# EAGLE schematic 8085_V1 (EAGLE 7.6.0)
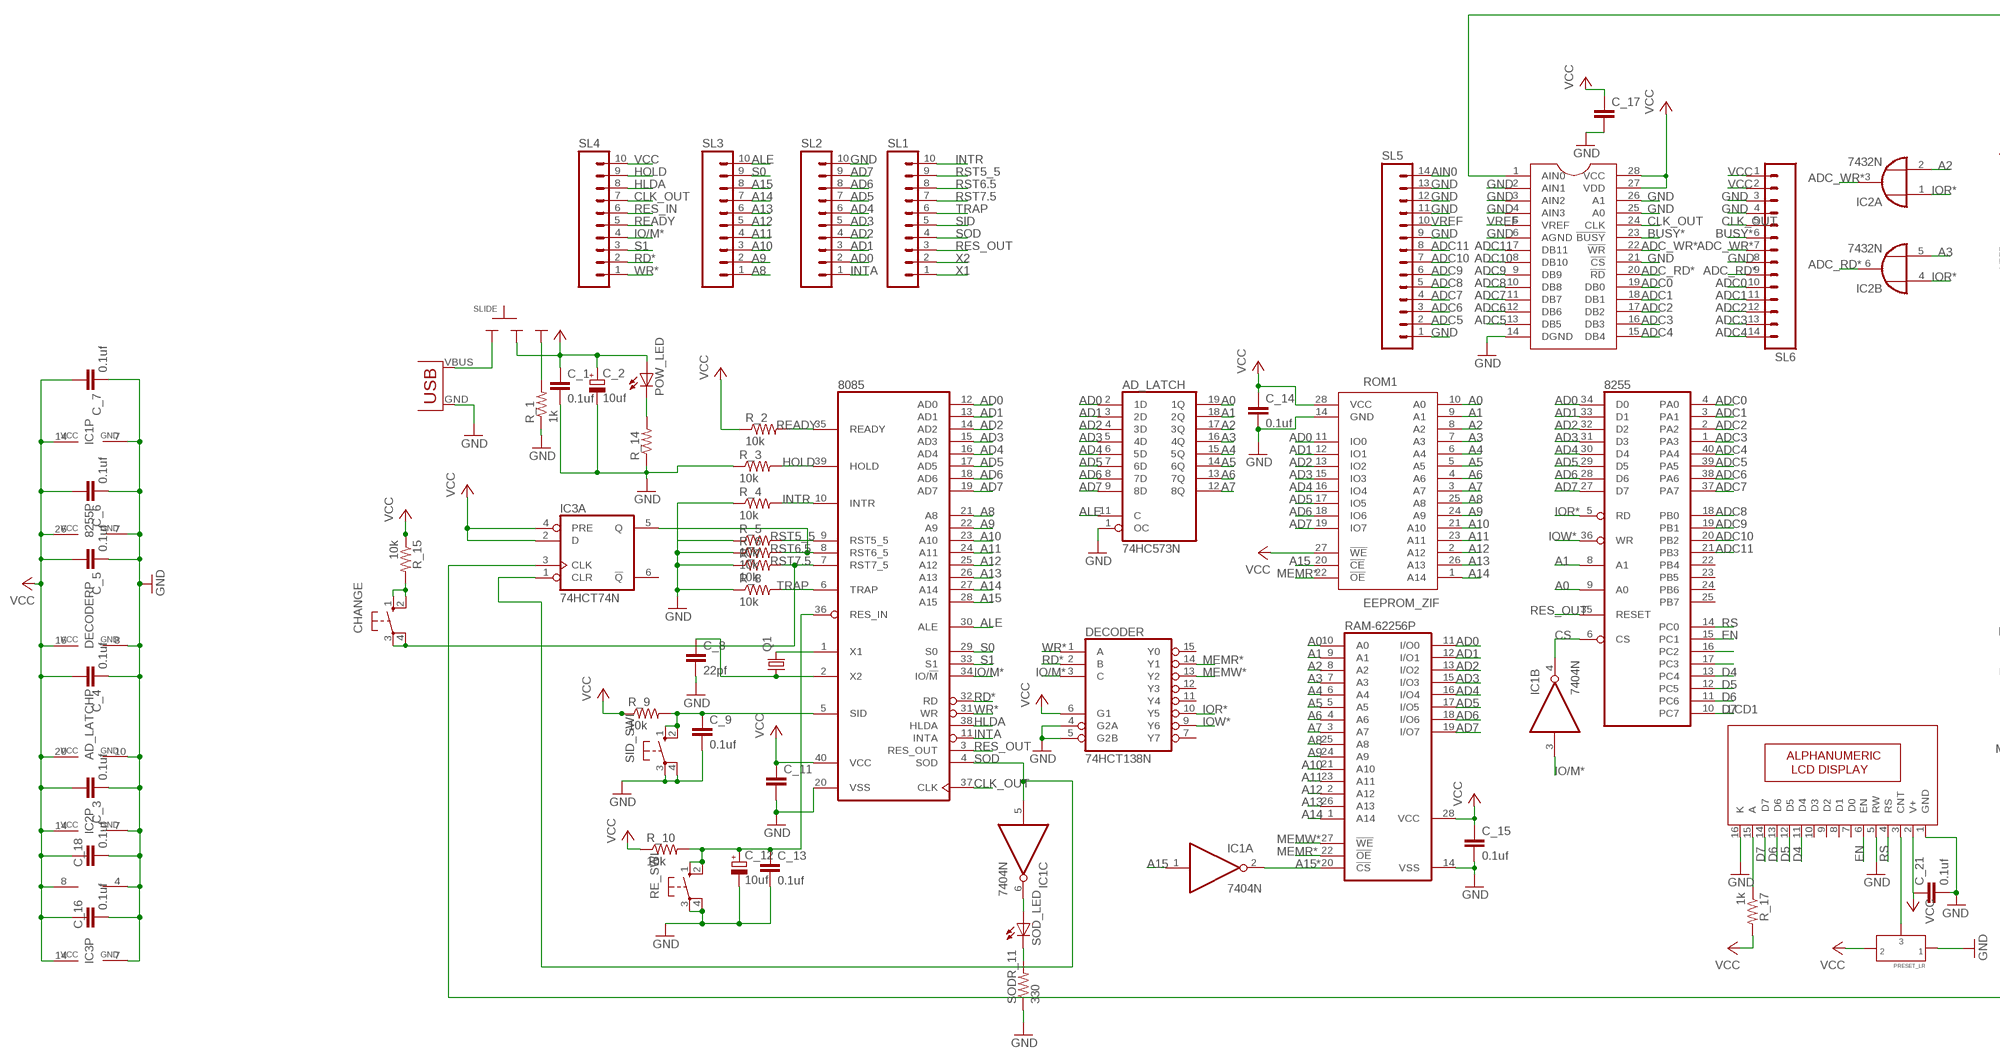
[diagram p0: schematic, sheet 1, part 1 of 2]
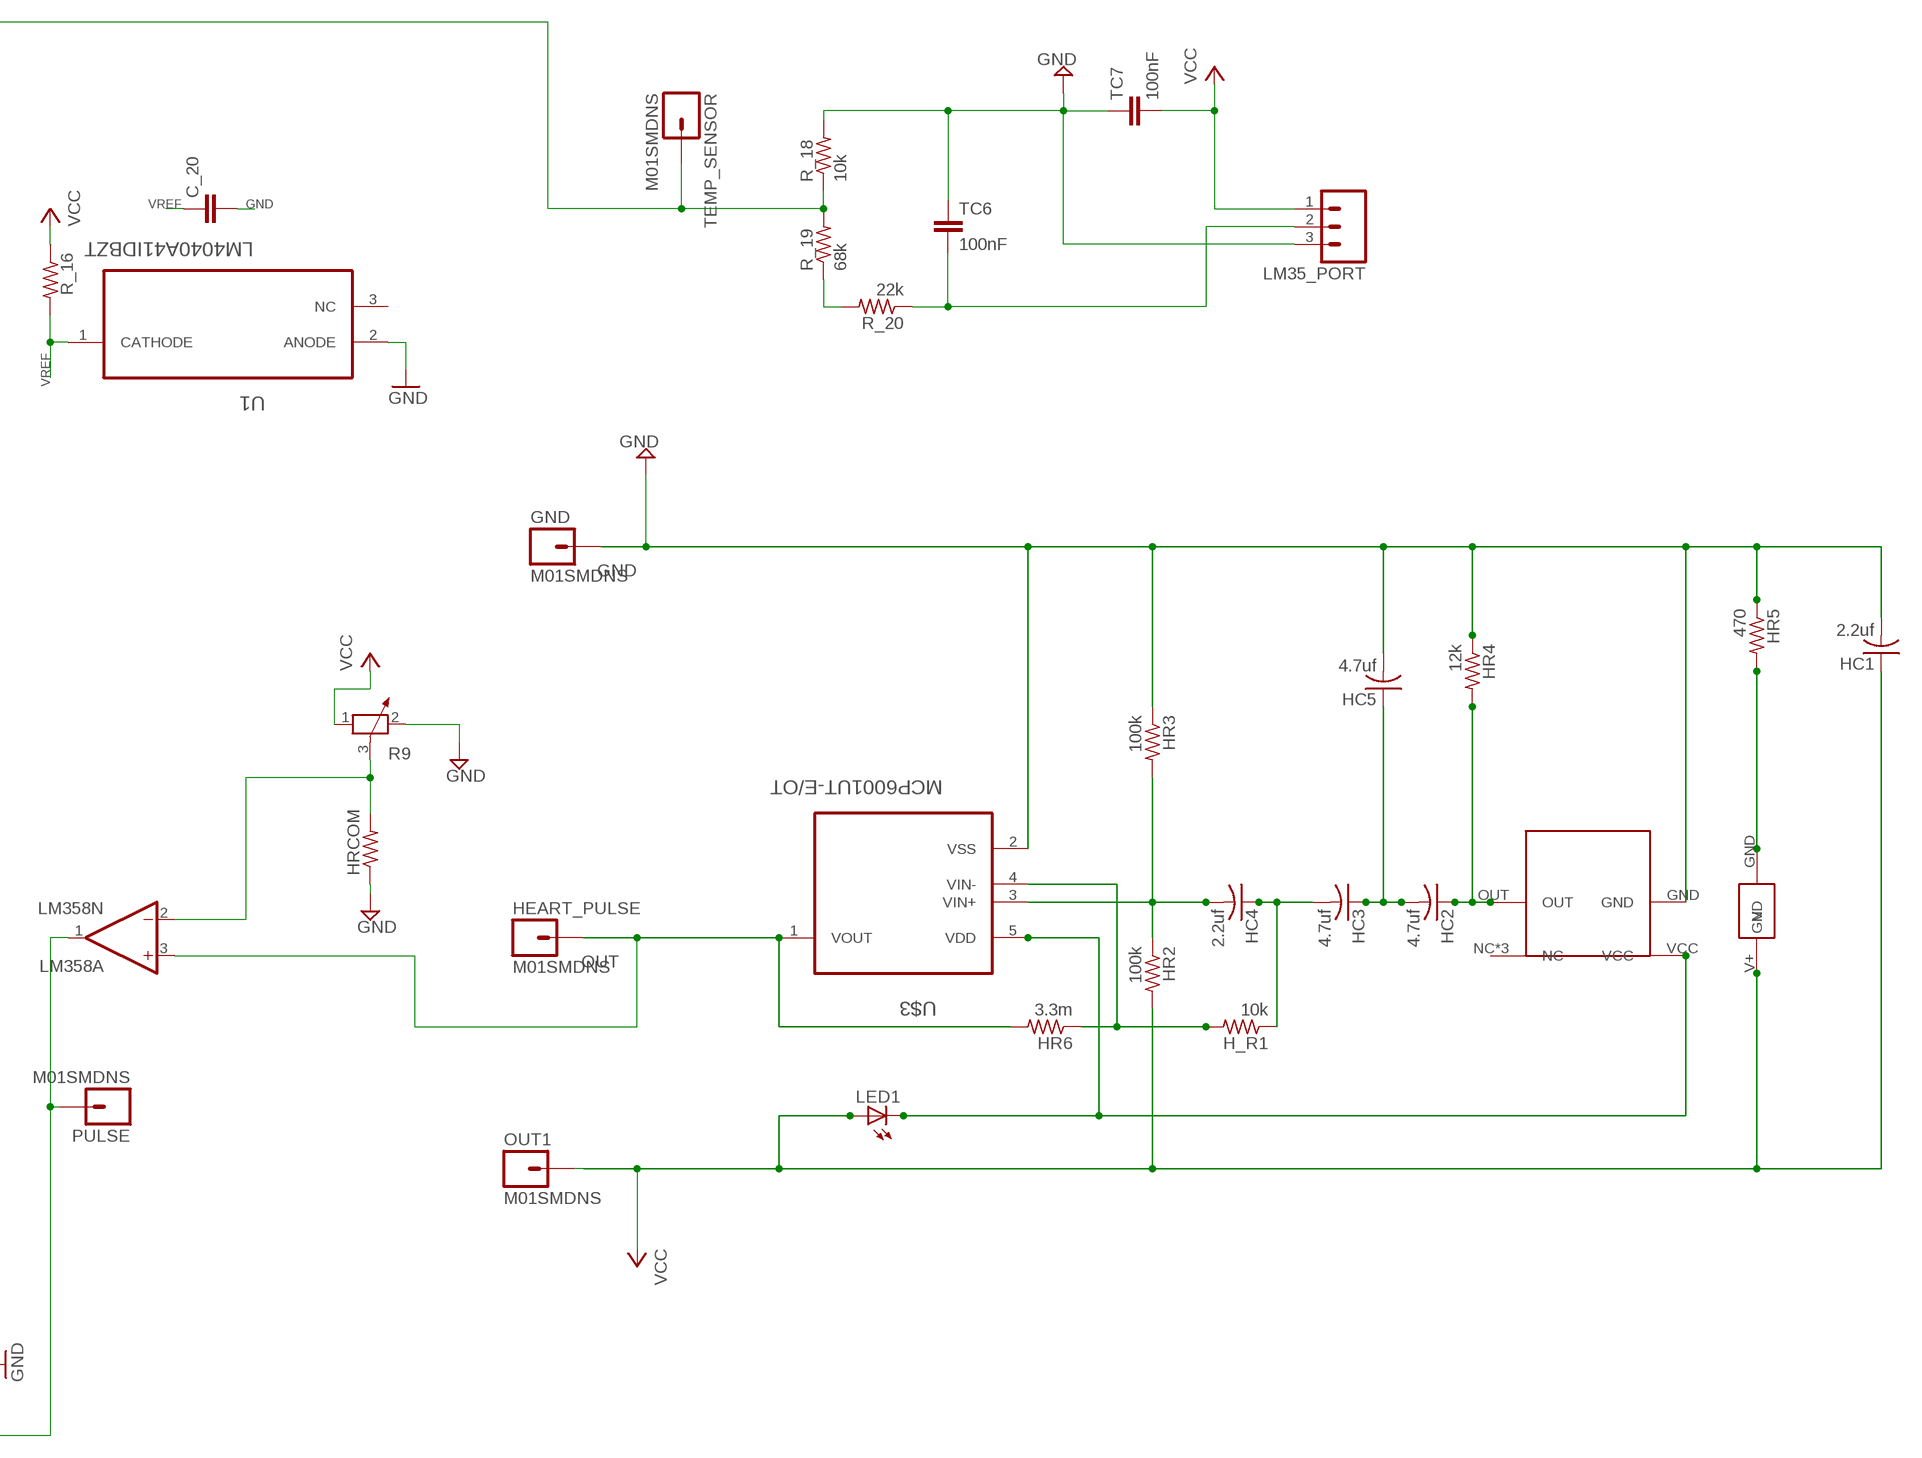
[diagram p1: schematic, sheet 1, part 2 of 2]

## Parts
8085  8085  [DIL40]
8255  8255A  [DIL40]
AD_LATCH  74HC573N  [DIL20]
ADC-1  ADS7842(12-ADC)  [SSOP28]
C_1  0.1uf  CAPACITOR-NON_POLAR025-025X050  [C025-025X050]
C_2  10uf  CAPACITOR-POLARE2.5-5  [E2,5-5]
C_3  0.1uf  C-EU025-025X050  [C025-025X050]
C_4  0.1uf  C-EU025-025X050  [C025-025X050]
C_5  0.1uf  C-EU025-025X050  [C025-025X050]
C_6  0.1uf  C-EU025-025X050  [C025-025X050]
C_7  0.1uf  C-EU025-025X050  [C025-025X050]
C_8  22pf  C-EU025-024X044  [C025-024X044]
C_9  0.1uf  C-EU025-024X044  [C025-024X044]
C_11  C-EU025-024X044  [C025-024X044]
C_12  10uf  CAPACITOR-POLARE2.5-5  [E2,5-5]
C_13  0.1uf  C-EU025-024X044  [C025-024X044]
C_14  0.1uf  C-EU025-024X044  [C025-024X044]
C_15  0.1uf  C-EU025-024X044  [C025-024X044]
C_16  0.1uf  C-EU025-025X050  [C025-025X050]
C_17  C-EU025-024X044  [C025-024X044]
C_18  0.1uf  C-EU025-025X050  [C025-025X050]
C_20  C-EU025-025X050  [C025-025X050]
C_21  0.1uf  C-EU025-024X044  [C025-024X044]
CHANGE  10-XX  [B3F-10XX]
DECODER  74HCT138N  [DIL16]
FINGERLED  KBREVMTNLED  [KBREVMNTLED]
GND  M01SMDNS  [1X01NS]
H_R1  10k  R-US_R0402  [R0402]
HC1  2.2uf  C-USC0402  [C0402]
HC2  4.7uf  C-USC0402  [C0402]
HC3  4.7uf  C-USC0402  [C0402]
HC4  2.2uf  C-USC0402  [C0402]
HC5  4.7uf  C-USC0402  [C0402]
HEART_PULSE  M01SMDNS  [1X01NS]
HR2  100k  R-US_R0402  [R0402]
HR3  100k  R-US_R0402  [R0402]
HR4  12k  R-US_R0402  [R0402]
HR5  470  R-US_R0402  [R0402]
HR6  3.3m  R-US_R0402  [R0402]
HRCOM  R-US_0204/7  [0204/7]
IC1  7404N  [DIL14]
IC2  7432N  [DIL14]
IC3  74HCT74N  [DIL14]
LCD1  16X2LCD  [16X2_LCD]
LED1  LEDCHIP-LED0603  [CHIP-LED0603]
LM35_PORT  M03  [03P]
LM358  LM358N  [DIL08]
OUT1  M01SMDNS  [1X01NS]
POW_LED  LED3MM  [LED3MM]
PULSE  M01SMDNS  [1X01NS]
Q1  CRYSTALHC49US  [HC49US]
R9  POTENTIOMETER_PT-10  [PT-10]
R_1  1k  R-US_0204/7  [0204/7]
R_2  10k  R-US_0204/7  [0204/7]
R_3  10k  R-US_0204/7  [0204/7]
R_4  10k  R-US_0204/7  [0204/7]
R_5  10k  R-US_0204/7  [0204/7]
R_6  10k  R-US_0204/7  [0204/7]
R_7  10k  R-US_0204/7  [0204/7]
R_8  10k  R-US_0204/7  [0204/7]
R_9  10k  R-US_0204/7  [0204/7]
R_10  10k  R-US_0204/7  [0204/7]
R_14  R-US_0204/7  [0204/7]
R_15  10k  R-US_0204/7  [0204/7]
R_16  RESISTOR0207/7  [0207/7]
R_17  1k  R-US_0204/7  [0204/7]
R_18  10k  R-US_0204/7  [0204/7]
R_19  68k  R-US_0204/7  [0204/7]
R_20  22k  R-US_0204/7  [0204/7]
RAM-62256P  62256P  [DIL28-6]
RE_SWI  10-XX  [B3F-10XX]
ROM1  EEPROM_ZIF  [DIL28-6-ZIF_SOCKET]
SID_SWI  10-XX  [B3F-10XX]
SL1  M10  [10P]
SL2  M10  [10P]
SL3  M10  [10P]
SL4  M10  [10P]
SL5  M14  [14P]
SL6  M14  [14P]
SLIDE  SLIDESWITCH-BIG  [BIGSWITCH]
SOD_LED  LED5MM  [LED5MM]
SODR_11  330  R-US_0204/7  [0204/7]
TC6  100nF  C-EU025-024X044  [C025-024X044]
TC7  100nF  C-EU025-024X044  [C025-024X044]
TEMP_SENSOR  M01SMDNS  [1X01NS]
U1  LM4040A41IDBZT  [SOT95P237X112-3N]
U$1  PRESET_LR  [PRESET_LR]
U$2  USB(POWER)  [USB(POWER)]
U$3  MCP6001UT-E/OT  [SOT95P270X145-5N]
U$4  APDS9008  [APDS9008]

## Nets
A0: 8255.9(A0) AD_LATCH.19(1Q) RAM-62256P.10(A0) ROM1.10(A0)
A1: 8255.8(A1) AD_LATCH.18(2Q) RAM-62256P.9(A1) ROM1.9(A1)
A2: AD_LATCH.17(3Q) IC2.2(A:I1) RAM-62256P.8(A2) ROM1.8(A2)
A3: AD_LATCH.16(4Q) IC2.5(B:I1) RAM-62256P.7(A3) ROM1.7(A3)
A4: AD_LATCH.15(5Q) RAM-62256P.6(A4) ROM1.6(A4)
A5: AD_LATCH.14(6Q) RAM-62256P.5(A5) ROM1.5(A5)
A6: AD_LATCH.13(7Q) RAM-62256P.4(A6) ROM1.4(A6)
A7: AD_LATCH.12(8Q) RAM-62256P.3(A7) ROM1.3(A7)
A8: 8085.21(A8) RAM-62256P.25(A8) ROM1.25(A8) SL3.1
A9: 8085.22(A9) RAM-62256P.24(A9) ROM1.24(A9) SL3.2
A10: 8085.23(A10) RAM-62256P.21(A10) ROM1.21(A10) SL3.3
A11: 8085.24(A11) RAM-62256P.23(A11) ROM1.23(A11) SL3.4
A12: 8085.25(A12) RAM-62256P.2(A12) ROM1.2(A12) SL3.5
A13: 8085.26(A13) RAM-62256P.26(A13) ROM1.26(A13) SL3.6
A14: 8085.27(A14) RAM-62256P.1(A14) ROM1.1(A14) SL3.7
A15: 8085.28(A15) IC1.1(A:I) ROM1.20(!CE) SL3.8
A15*: IC1.2(A:O) RAM-62256P.20(!CS)
AD0: 8085.12(AD0) 8255.34(D0) AD_LATCH.2(1D) RAM-62256P.11(I/O0) ROM1.11(IO0) SL2.2
AD1: 8085.13(AD1) 8255.33(D1) AD_LATCH.3(2D) RAM-62256P.12(I/O1) ROM1.12(IO1) SL2.3
AD2: 8085.14(AD2) 8255.32(D2) AD_LATCH.4(3D) RAM-62256P.13(I/O2) ROM1.13(IO2) SL2.4
AD3: 8085.15(AD3) 8255.31(D3) AD_LATCH.5(4D) RAM-62256P.15(I/O3) ROM1.15(IO3) SL2.5
AD4: 8085.16(AD4) 8255.30(D4) AD_LATCH.6(5D) RAM-62256P.16(I/O4) ROM1.16(IO4) SL2.6
AD5: 8085.17(AD5) 8255.29(D5) AD_LATCH.7(6D) RAM-62256P.17(I/O5) ROM1.17(IO5) SL2.7
AD6: 8085.18(AD6) 8255.28(D6) AD_LATCH.8(7D) RAM-62256P.18(I/O6) ROM1.18(IO6) SL2.8
AD7: 8085.19(AD7) 8255.27(D7) AD_LATCH.9(8D) RAM-62256P.19(I/O7) ROM1.19(IO7) SL2.9
ADC0: 8255.4(PA0) ADC-1.19(DB0) SL6.10
ADC1: 8255.3(PA1) ADC-1.18(DB1) SL6.11
ADC2: 8255.2(PA2) ADC-1.17(DB2) SL6.12
ADC3: 8255.1(PA3) ADC-1.16(DB3) SL6.13
ADC4: 8255.40(PA4) ADC-1.15(DB4) SL6.14
ADC5: 8255.39(PA5) ADC-1.13(DB5) SL5.2
ADC6: 8255.38(PA6) ADC-1.12(DB6) SL5.3
ADC7: 8255.37(PA7) ADC-1.11(DB7) SL5.4
ADC8: 8255.18(PB0) ADC-1.10(DB8) SL5.5
ADC9: 8255.19(PB1) ADC-1.9(DB9) SL5.6
ADC10: 8255.20(PB2) ADC-1.8(DB10) SL5.7
ADC11: 8255.21(PB3) ADC-1.7(DB11) SL5.8
ADC_RD*: ADC-1.20(!RD) IC2.6(B:O) SL6.9
ADC_WR*: ADC-1.22(!WR) IC2.3(A:O) SL6.7
AIN0: SL5.14
ALE: 8085.30(ALE) AD_LATCH.11(C) SL3.10
BUSY*: ADC-1.23(!BUSY) SL6.6
CLK_OUT: 8085.37(CLK) ADC-1.24(CLK) SL4.7 SL6.5
CS: 8255.6(CS) IC1.4(B:O)
D4: 8255.13(PC4) LCD1.11(D4)
D5: 8255.12(PC5) LCD1.12(D5)
D6: 8255.11(PC6) LCD1.13(D6)
D7: 8255.10(PC7) LCD1.14(D7)
EN: 8255.15(PC1) LCD1.6(EN)
GND: 8085.20(VSS) 8255.7(GND) AD_LATCH.1(OC) AD_LATCH.10(GND) ADC-1.2(AIN1) ADC-1.3(AIN2) ADC-1.4(AIN3) ADC-1.6(AGND) ADC-1.14(DGND) ADC-1.21(!CS) ADC-1.25(A0) ADC-1.26(A1) C_1.2 C_2.- C_3.2 C_4.2 C_5.2 C_6.2 C_7.2 C_8.2 C_9.2 C_11.2 C_12.- C_13.2 C_14.2 C_15.2 C_16.2 C_17.2 C_18.2 C_20.2 C_21.2 DECODER.4(G2A) DECODER.5(G2B) DECODER.8(GND) GND.1 HC1.2 HC5.2 HR3.1 HR4.1 HR5.1 HRCOM.1 IC1.7(P:GND) IC2.7(P:GND) IC3.7(P:GND) LCD1.1(GND) LCD1.5(RW) LCD1.16(K) LM35_PORT.3 LM358.4(P:V-) R9.2 R_1.1 R_3.1 R_4.1 R_5.1 R_6.1 R_7.1 R_8.1 R_14.1 R_18.2 RAM-62256P.14(VSS) RE_SWI.3(P) RE_SWI.4(P1) ROM1.14(GND) SID_SWI.3(P) SID_SWI.4(P1) SL2.10 SL5.1 SL5.9 SL5.11 SL5.12 SL5.13 SL6.3 SL6.4 SL6.8 SODR_11.1 TC6.1 TC7.1 U1.2(ANODE) U$1.P$1 U$2.GND U$3.2(VSS) U$4.GND
HLDA: 8085.38(HLDA) SL4.8
HOLD: 8085.39(HOLD) R_3.2 SL4.9
INTA: 8085.11(INTA) SL2.1
INTR: 8085.10(INTR) R_4.2 SL1.10
IO/M*: 8085.34(IO/!M) DECODER.3(C) IC1.3(B:I) SL4.4
IOR*: 8255.5(RD) DECODER.10(Y5) IC2.1(A:I0) IC2.4(B:I0)
IOW*: 8255.36(WR) DECODER.9(Y6)
MEMR*: DECODER.14(Y1) RAM-62256P.22(!OE) ROM1.22(!OE)
MEMW*: DECODER.13(Y2) RAM-62256P.27(!WE)
N$1: SOD_LED.K(C) SODR_11.2
N$2: POW_LED.K(C) R_14.2
N$3: IC1.6(C:O) SOD_LED.A
N$4: LED1.C U$3.5(VDD) U$4.VCC
N$5: HC2.2 HC3.1 HC5.1
N$6: 8255.16(PC2)
N$7: 8255.17(PC3)
N$8: H_R1.1 HC3.2 HC4.1
N$9: HC4.2 HR2.1 HR3.2 U$3.3(VIN+)
N$10: H_R1.2 HR6.1 U$3.4(VIN-)
N$11: HC2.1 HR4.2 U$4.OUT
N$12: FINGERLED.GND HR5.2
N$13: ADC-1.1(AIN0) R_18.1 R_19.2 TEMP_SENSOR.1
N$14: LM35_PORT.2 R_20.1 TC6.2
N$16: LCD1.3(CNT) U$1.P$3
N$17: R_19.1 R_20.2
N$19: HRCOM.2 LM358.2(A:-IN) R9.3
N$20: IC3.3(A:CLK) LM358.1(A:OUT) PULSE.1
N$29: LCD1.15(A) R_17.1
N$31: SLIDE.1 U$2.VBUS(VCC)
N$32: R_1.2 SLIDE.3
OUT: HEART_PULSE.1 HR6.2 LM358.3(A:+IN) U$3.1(VOUT)
RD*: 8085.32(RD) DECODER.2(B) SL4.2
READY: 8085.35(READY) R_2.2 SL4.5
RES_IN: 8085.36(RES_IN) C_12.+ C_13.1 R_10.2 RE_SWI.1(S) RE_SWI.2(S1) SL4.6
RES_OUT: 8085.3(RES_OUT) 8255.35(RESET) SL1.3
RS: 8255.14(PC0) LCD1.4(RS)
RST5_5: 8085.9(RST5_5) R_5.2 SL1.9
RST6.5: 8085.8(RST6_5) IC3.5(A:Q) R_6.2 SL1.8
RST7.5: 8085.7(RST7_5) CHANGE.3(P) CHANGE.4(P1) R_7.2 SL1.7
S0: 8085.29(S0) SL3.9
S1: 8085.33(S1) SL4.3
SID: 8085.5(SID) C_9.1 R_9.2 SID_SWI.1(S) SID_SWI.2(S1) SL1.5
SID1: CHANGE.1(S) CHANGE.2(S1) R_15.2
SOD: 8085.4(SOD) IC1.5(C:I) IC3.1(A:CLR) SL1.4
TRAP: 8085.6(TRAP) R_8.2 SL1.6
VCC: 8085.40(VCC) 8255.26(VCC) AD_LATCH.20(VCC) ADC-1.27(VDD) ADC-1.28(VCC) C_1.1 C_2.+ C_3.1 C_4.1 C_5.1 C_6.1 C_7.1 C_11.1 C_14.1 C_15.1 C_16.1 C_17.1 C_18.1 C_21.1 DECODER.6(G1) DECODER.16(VCC) FINGERLED.V+(V) HC1.1 HR2.2 IC1.14(P:VCC) IC2.14(P:VCC) IC3.2(A:D) IC3.4(A:PRE) IC3.14(P:VCC) LCD1.2(V+) LED1.A LM35_PORT.1 LM358.8(P:V+) OUT1.1 POW_LED.A R9.1 R_2.1 R_9.1 R_10.1 R_15.1 R_16.1 R_17.2 RAM-62256P.28(VCC) ROM1.27(!WE) ROM1.28(VCC) SL4.10 SL6.1 SL6.2 SLIDE.2 TC7.2 U$1.P$2
VREF [power]: ADC-1.5(VREF) C_20.1 R_16.2 SL5.10 U1.1(CATHODE)
WR*: 8085.31(WR) DECODER.1(A) SL4.1
X1: 8085.1(X1) Q1.2 SL1.1
X2: 8085.2(X2) C_8.1 Q1.1 SL1.2
Unconnected: 8255.22(PB4) 8255.23(PB5) 8255.24(PB6) 8255.25(PB7) DECODER.7(Y7) DECODER.11(Y4) DECODER.12(Y3) DECODER.15(Y0) IC1.8(D:O) IC1.9(D:I) IC1.10(E:O) IC1.11(E:I) IC1.12(F:O) IC1.13(F:I) IC2.8(C:O) IC2.9(C:I0) IC2.10(C:I1) IC2.11(D:O) IC2.12(D:I0) IC2.13(D:I1) IC3.6(A:!Q) IC3.8(B:!Q) IC3.9(B:Q) IC3.10(B:PRE) IC3.11(B:CLK) IC3.12(B:D) IC3.13(B:CLR) LCD1.7(D0) LCD1.8(D1) LCD1.9(D2) LCD1.10(D3) LM358.5(B:+IN) LM358.6(B:-IN) LM358.7(B:OUT) U1.3(NC) U$4.NC U$4.NCC1(NC) U$4.NCC(NC)

## Library data of the parts
8085 = micro-intel:8085: MICROCOMPUTER/PERIPHERAL DEVICE; OC_FARNELL: unknown; OC_NEWARK: unknown
8255 = micro-intel:8255A: MICROCOMPUTER/PERIPHERAL DEVICE; OC_FARNELL: unknown; OC_NEWARK: unknown
AD_LATCH = 74xx-eu:74*573: 8-bit D latch BUS DRIVER
ADC-1 = ADS7842(12Bit_ADC):ADS7842(12-ADC)
C_1 = MSP PROJECT LIBRARY:CAPACITOR-NON_POLAR: CAPACITOR, European symbol
C_2 C_12 = MSP PROJECT LIBRARY:CAPACITOR-POLAR: POLARIZED CAPACITOR, European symbol
C_3-C_7 C_16 C_18 = resistor:C-EU: CAPACITOR, European symbol
C_8 C_9 C_11 C_13-C_15 C_17 C_20 C_21 TC6 TC7 = rcl:C-EU: CAPACITOR, European symbol
CHANGE RE_SWI SID_SWI = switch-omron:10-XX: OMRON SWITCH; MPN: B3F-1000; OC_FARNELL: 176432; OC_NEWARK: 36M3542
DECODER = 74xx-eu:74*138: 3-line to 8-line DECODER/DEMULTIPLEXER
FINGERLED = untitled:KBREVMTNLED
GND HEART_PULSE OUT1 PULSE TEMP_SENSOR = SparkFun:M01: Header 1 Standard 1-pin 0.1" header. Use with straight break away headers (SKU : PRT-00116), right angle break away headers (PRT-00553), swiss pins (PRT-00743), machine pins (PRT-00117), and female headers (PRT-00115).
H_R1 HR2-HR6 = resistor:R-US_: RESISTOR, American symbol
HC1-HC5 = resistor:C-US: CAPACITOR, American symbol
HRCOM R_1-R_10 R_14 R_15 R_17-R_20 SODR_11 = rcl:R-US_: RESISTOR, American symbol
IC1 = 74xx-eu:74*04: Hex INVERTER
IC2 = 74xx-eu:74*32: Quad 2-input OR gate
IC3 = 74xx-eu:74*74: Dual D type positive edge triggered FLIP FLOP, preset and clear
LCD1 = CEDT_JANUARY_2015_v5:16X2LCD: ALPHANUMERIC-LCD
LED1 = led:LED: LED OSRAM: - CHIPLED LG R971, LG N971, LY N971, LG Q971, LY Q971, LO R971, LY R971 LH N974, LH R974 LS Q976, LO Q976, LY Q976 LO Q996 - Hyper CHIPLED LW Q18S LB Q993, LB Q99A, LB R99A - SideLED LS A670, LO A670, LY A670, LG A670, LP A670 LB A673, LV A673, LT A673, LW A673 LH A674 LY A675 LS A676, LA A676, LO A676, LY A676, LW A676 LS A679, LY A679, LG A679 - Hyper Micro SIDELED® LS Y876, LA Y876, LO Y876, LY Y876 LT Y87S - SmartLED LW L88C, LW L88S LB L89C, LB L89S, LG L890 LS L89K, LO L89K, LY L89K LS L896, LA L896, LO L896, LY L896 - TOPLED LS T670, LO T670, LY T670, LG T670, LP T670 LSG T670, LSP T670, LSY T670, LOP T670, LYG T670 LG T671, LOG T671, LSG T671 LB T673, LV T673, LT T673, LW T673 LH T674 LS T676, LA T676, LO T676, LY T676, LB T676, LH T676, LSB T676, LW T676 LB T67C, LV T67C, LT T67C, LS T67K, LO T67K, LY T67K, LW E67C LS E67B, LA E67B, LO E67B, LY E67B, LB E67C, LV E67C, LT E67C LW T67C LS T679, LY T679, LG T679 LS T770, LO T770, LY T770, LG T770, LP T770 LB T773, LV T773, LT T773, LW T773 LH T774 LS E675, LA E675, LY E675, LS T675 LS T776, LA T776, LO T776, LY T776, LB T776 LHGB T686 LT T68C, LB T68C - Hyper Mini TOPLED® LB M676 - Mini TOPLED Santana® LG M470 LS M47K, LO M47K, LY M47K Source: http://www.osram.convergy.de LUXEON: - LUMILED® LXK2-PW12-R00, LXK2-PW12-S00, LXK2-PW14-U00, LXK2-PW14-V00 LXK2-PM12-R00, LXK2-PM12-S00, LXK2-PM14-U00 LXK2-PE12-Q00, LXK2-PE12-R00, LXK2-PE12-S00, LXK2-PE14-T00, LXK2-PE14-U00 LXK2-PB12-K00, LXK2-PB12-L00, LXK2-PB12-M00, LXK2-PB14-N00, LXK2-PB14-P00, LXK2-PB14-Q00 LXK2-PR12-L00, LXK2-PR12-M00, LXK2-PR14-Q00, LXK2-PR14-R00 LXK2-PD12-Q00, LXK2-PD12-R00, LXK2-PD12-S00 LXK2-PH12-R00, LXK2-PH12-S00 LXK2-PL12-P00, LXK2-PL12-Q00, LXK2-PL12-R00 Source: www.luxeon.com KINGBRIGHT: KA-3528ASYC Source: www.kingbright.com
LM35_PORT = con-amp-quick:M03: AMP QUICK CONNECTOR; OC_FARNELL: unknown; OC_NEWARK: unknown
LM358 = CEDT_JANUARY_2015_v5:LM358: OP AMP also LM158; LM258; LM2904 Source: http://cache.national.com/ds/LM/LM158.pdf
POW_LED = CEDTv81:LED
Q1 = CEDT_JANUARY_2015_v5:CRYSTAL: Crystals Various standard crystals. Proven footprints. Spark Fun Electronics SKU : COM-00534
R9 = rcl:POTENTIOMETER_: Potentiometer
R_16 = CEDT_JANUARY_2015_v6 (2):RESISTOR
RAM-62256P = memory-hitachi:62256P: MEMORY; OC_FARNELL: unknown; OC_NEWARK: unknown
ROM1 = eepromzif:EEPROM_ZIF
SL1-SL4 = con-amp-quick:M10: AMP QUICK CONNECTOR; OC_FARNELL: unknown; OC_NEWARK: unknown
SL5 SL6 = con-amp-quick:M14: AMP QUICK CONNECTOR; OC_FARNELL: unknown; OC_NEWARK: unknown
SLIDE = CEDT_JANUARY_2015_v5_a:SLIDESWITCH
SOD_LED = CEDT_JANUARY_2015_v5:LED
U1 = Texas Instruments_By_element14_Batch_1:LM4040A41IDBZT: PRECISION MICROPOWER SHUNT VOLTAGE REFERENCE; MPN: LM4040A41IDBZT; OC_FARNELL: 1755107; OC_NEWARK: 66K2443; PACKAGE: 3-SOT-23; SUPPLIER: TEXAS INSTRUMENTS
U$1 = CEDT_JANUARY_2015_v5:PRESET_LR
U$2 = CEDT_JANUARY_2015_v5:USB(POWER)
U$3 = untitled:MCP6001UT-E/OT: 1 MHz, Low-Power Op Amp; MPN: MCP6001UT-E/OT; OC_FARNELL: 1840893; OC_NEWARK: 84R5183; PACKAGE: SOT23-5; SUPPLIER: Microchip
U$4 = untitled:APDS9008

## Net classes
0 default: width 0.305 mm, clearance 0.305 mm
1 VCC: width 0.61 mm, clearance 0.305 mm to class 0, clearance 0.305 mm
2 GND: width 0.61 mm, clearance 0.305 mm to class 0, clearance 0.305 mm to class 1, clearance 0.305 mm
3 power: width 0.406 mm